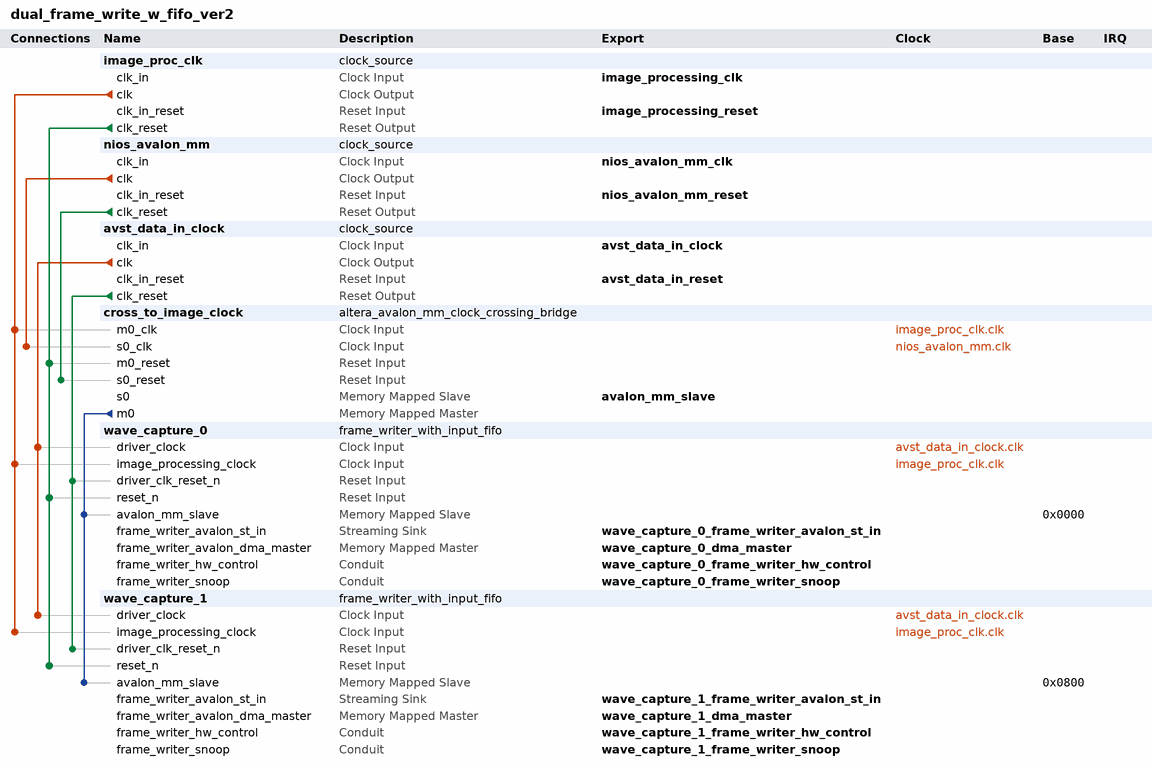
[diagram p0: system contents]
# Platform Designer (Qsys) system dual_frame_write_w_fifo_ver2, Arria V 5AGXFB5H4F35C4
# Parameters at their usual value, and those the tool derives, are not listed.
package require -exact qsys 18.1
create_system dual_frame_write_w_fifo_ver2
set_project_property DEVICE_FAMILY {Arria V}
set_project_property DEVICE 5AGXFB5H4F35C4

add_instance image_proc_clk clock_source 18.1
set_instance_parameter_value image_proc_clk clockFrequency 100000000
set_instance_parameter_value image_proc_clk clockFrequencyKnown false
set_instance_parameter_value image_proc_clk resetSynchronousEdges BOTH

add_instance nios_avalon_mm clock_source 18.1
set_instance_parameter_value nios_avalon_mm clockFrequency 50000000
set_instance_parameter_value nios_avalon_mm clockFrequencyKnown false
set_instance_parameter_value nios_avalon_mm resetSynchronousEdges BOTH

add_instance avst_data_in_clock clock_source 18.1
set_instance_parameter_value avst_data_in_clock clockFrequency 100000000
set_instance_parameter_value avst_data_in_clock clockFrequencyKnown false
set_instance_parameter_value avst_data_in_clock resetSynchronousEdges BOTH

add_instance cross_to_image_clock altera_avalon_mm_clock_crossing_bridge 18.1
set_instance_parameter_value cross_to_image_clock ADDRESS_WIDTH 28
set_instance_parameter_value cross_to_image_clock COMMAND_FIFO_DEPTH 4
set_instance_parameter_value cross_to_image_clock DATA_WIDTH 32
set_instance_parameter_value cross_to_image_clock MASTER_SYNC_DEPTH 2
set_instance_parameter_value cross_to_image_clock MAX_BURST_SIZE 1
set_instance_parameter_value cross_to_image_clock RESPONSE_FIFO_DEPTH 4
set_instance_parameter_value cross_to_image_clock SLAVE_SYNC_DEPTH 2
set_instance_parameter_value cross_to_image_clock USE_AUTO_ADDRESS_WIDTH 1

add_instance wave_capture_0 frame_writer_with_input_fifo 1.0
set_instance_parameter_value wave_capture_0 address_width 32
set_instance_parameter_value wave_capture_0 dma_enabled_at_startup 0
set_instance_parameter_value wave_capture_0 num_of_bits_per_pixel 16
set_instance_parameter_value wave_capture_0 num_of_locations_in_fifo 128
set_instance_parameter_value wave_capture_0 num_of_pixels_in_frame 1048576
set_instance_parameter_value wave_capture_0 num_watchdog_bits 64
set_instance_parameter_value wave_capture_0 override_external_swap_buffers_now 0
set_instance_parameter_value wave_capture_0 override_val_for_external_swap_buffers_now 0
set_instance_parameter_value wave_capture_0 parallelization_ratio 8
set_instance_parameter_value wave_capture_0 swap_symbol_order_for_dma 0
set_instance_parameter_value wave_capture_0 watchdog_enabled 0
set_instance_parameter_value wave_capture_0 watchdog_limit 1234

add_instance wave_capture_1 frame_writer_with_input_fifo 1.0
set_instance_parameter_value wave_capture_1 address_width 32
set_instance_parameter_value wave_capture_1 dma_enabled_at_startup 0
set_instance_parameter_value wave_capture_1 num_of_bits_per_pixel 16
set_instance_parameter_value wave_capture_1 num_of_locations_in_fifo 128
set_instance_parameter_value wave_capture_1 num_of_pixels_in_frame 1048576
set_instance_parameter_value wave_capture_1 num_watchdog_bits 64
set_instance_parameter_value wave_capture_1 override_external_swap_buffers_now 0
set_instance_parameter_value wave_capture_1 override_val_for_external_swap_buffers_now 0
set_instance_parameter_value wave_capture_1 parallelization_ratio 8
set_instance_parameter_value wave_capture_1 swap_symbol_order_for_dma 0
set_instance_parameter_value wave_capture_1 watchdog_enabled 0
set_instance_parameter_value wave_capture_1 watchdog_limit 1234

# connections
add_connection avst_data_in_clock.clk wave_capture_0.driver_clock clock
add_connection avst_data_in_clock.clk wave_capture_1.driver_clock clock
add_connection image_proc_clk.clk cross_to_image_clock.m0_clk clock
add_connection image_proc_clk.clk wave_capture_0.image_processing_clock clock
add_connection image_proc_clk.clk wave_capture_1.image_processing_clock clock
add_connection nios_avalon_mm.clk cross_to_image_clock.s0_clk clock
add_connection avst_data_in_clock.clk_reset wave_capture_0.driver_clk_reset_n reset
add_connection avst_data_in_clock.clk_reset wave_capture_1.driver_clk_reset_n reset
add_connection image_proc_clk.clk_reset cross_to_image_clock.m0_reset reset
add_connection image_proc_clk.clk_reset wave_capture_0.reset_n reset
add_connection image_proc_clk.clk_reset wave_capture_1.reset_n reset
add_connection nios_avalon_mm.clk_reset cross_to_image_clock.s0_reset reset
add_connection cross_to_image_clock.m0 wave_capture_0.avalon_mm_slave avalon
set_connection_parameter_value cross_to_image_clock.m0/wave_capture_0.avalon_mm_slave baseAddress 0x0000
add_connection cross_to_image_clock.m0 wave_capture_1.avalon_mm_slave avalon
set_connection_parameter_value cross_to_image_clock.m0/wave_capture_1.avalon_mm_slave baseAddress 0x0800

# exported interfaces
add_interface avalon_mm_slave avalon slave
set_interface_property avalon_mm_slave EXPORT_OF cross_to_image_clock.s0
add_interface avst_data_in_clock clock sink
set_interface_property avst_data_in_clock EXPORT_OF avst_data_in_clock.clk_in
add_interface avst_data_in_reset reset sink
set_interface_property avst_data_in_reset EXPORT_OF avst_data_in_clock.clk_in_reset
add_interface image_processing_clk clock sink
set_interface_property image_processing_clk EXPORT_OF image_proc_clk.clk_in
add_interface image_processing_reset reset sink
set_interface_property image_processing_reset EXPORT_OF image_proc_clk.clk_in_reset
add_interface nios_avalon_mm_clk clock sink
set_interface_property nios_avalon_mm_clk EXPORT_OF nios_avalon_mm.clk_in
add_interface nios_avalon_mm_reset reset sink
set_interface_property nios_avalon_mm_reset EXPORT_OF nios_avalon_mm.clk_in_reset
add_interface wave_capture_0_dma_master avalon master
set_interface_property wave_capture_0_dma_master EXPORT_OF wave_capture_0.frame_writer_avalon_dma_master
add_interface wave_capture_0_frame_writer_avalon_st_in avalon_streaming sink
set_interface_property wave_capture_0_frame_writer_avalon_st_in EXPORT_OF wave_capture_0.frame_writer_avalon_st_in
add_interface wave_capture_0_frame_writer_hw_control conduit end
set_interface_property wave_capture_0_frame_writer_hw_control EXPORT_OF wave_capture_0.frame_writer_hw_control
add_interface wave_capture_0_frame_writer_snoop conduit end
set_interface_property wave_capture_0_frame_writer_snoop EXPORT_OF wave_capture_0.frame_writer_snoop
add_interface wave_capture_1_dma_master avalon master
set_interface_property wave_capture_1_dma_master EXPORT_OF wave_capture_1.frame_writer_avalon_dma_master
add_interface wave_capture_1_frame_writer_avalon_st_in avalon_streaming sink
set_interface_property wave_capture_1_frame_writer_avalon_st_in EXPORT_OF wave_capture_1.frame_writer_avalon_st_in
add_interface wave_capture_1_frame_writer_hw_control conduit end
set_interface_property wave_capture_1_frame_writer_hw_control EXPORT_OF wave_capture_1.frame_writer_hw_control
add_interface wave_capture_1_frame_writer_snoop conduit end
set_interface_property wave_capture_1_frame_writer_snoop EXPORT_OF wave_capture_1.frame_writer_snoop

set_interconnect_requirement {$system} qsys_mm.clockCrossingAdapter AUTO
set_interconnect_requirement {$system} qsys_mm.insertDefaultSlave FALSE
set_interconnect_requirement {$system} qsys_mm.maxAdditionalLatency 3

save_system dual_frame_write_w_fifo_ver2.qsys
